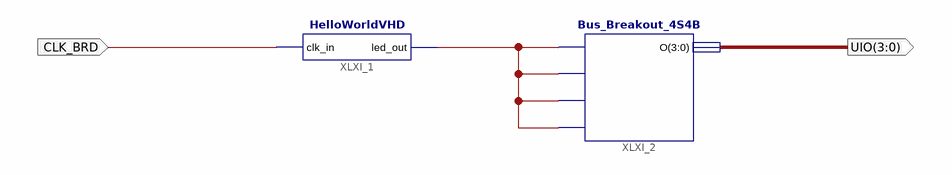
[diagram p0: schematic sheet 1]
// Xilinx ISE schematic HelloWorldSCH.sch (spartan6) as structural Verilog: 2 symbols, 2 ports
module HelloWorldSCH (
  input  CLK_BRD,
  output [3:0] UIO
);

  wire XLXN_4;

  HelloWorldVHD XLXI_1 (.clk_in(CLK_BRD), .led_out(XLXN_4));
  Bus_Breakout_4S4B XLXI_2 (.I0(XLXN_4), .I1(XLXN_4), .I2(XLXN_4), .I3(XLXN_4), .O(UIO));
endmodule
